# Altium schematic sheet SM2200.SchDoc
size 342 x 203 mm
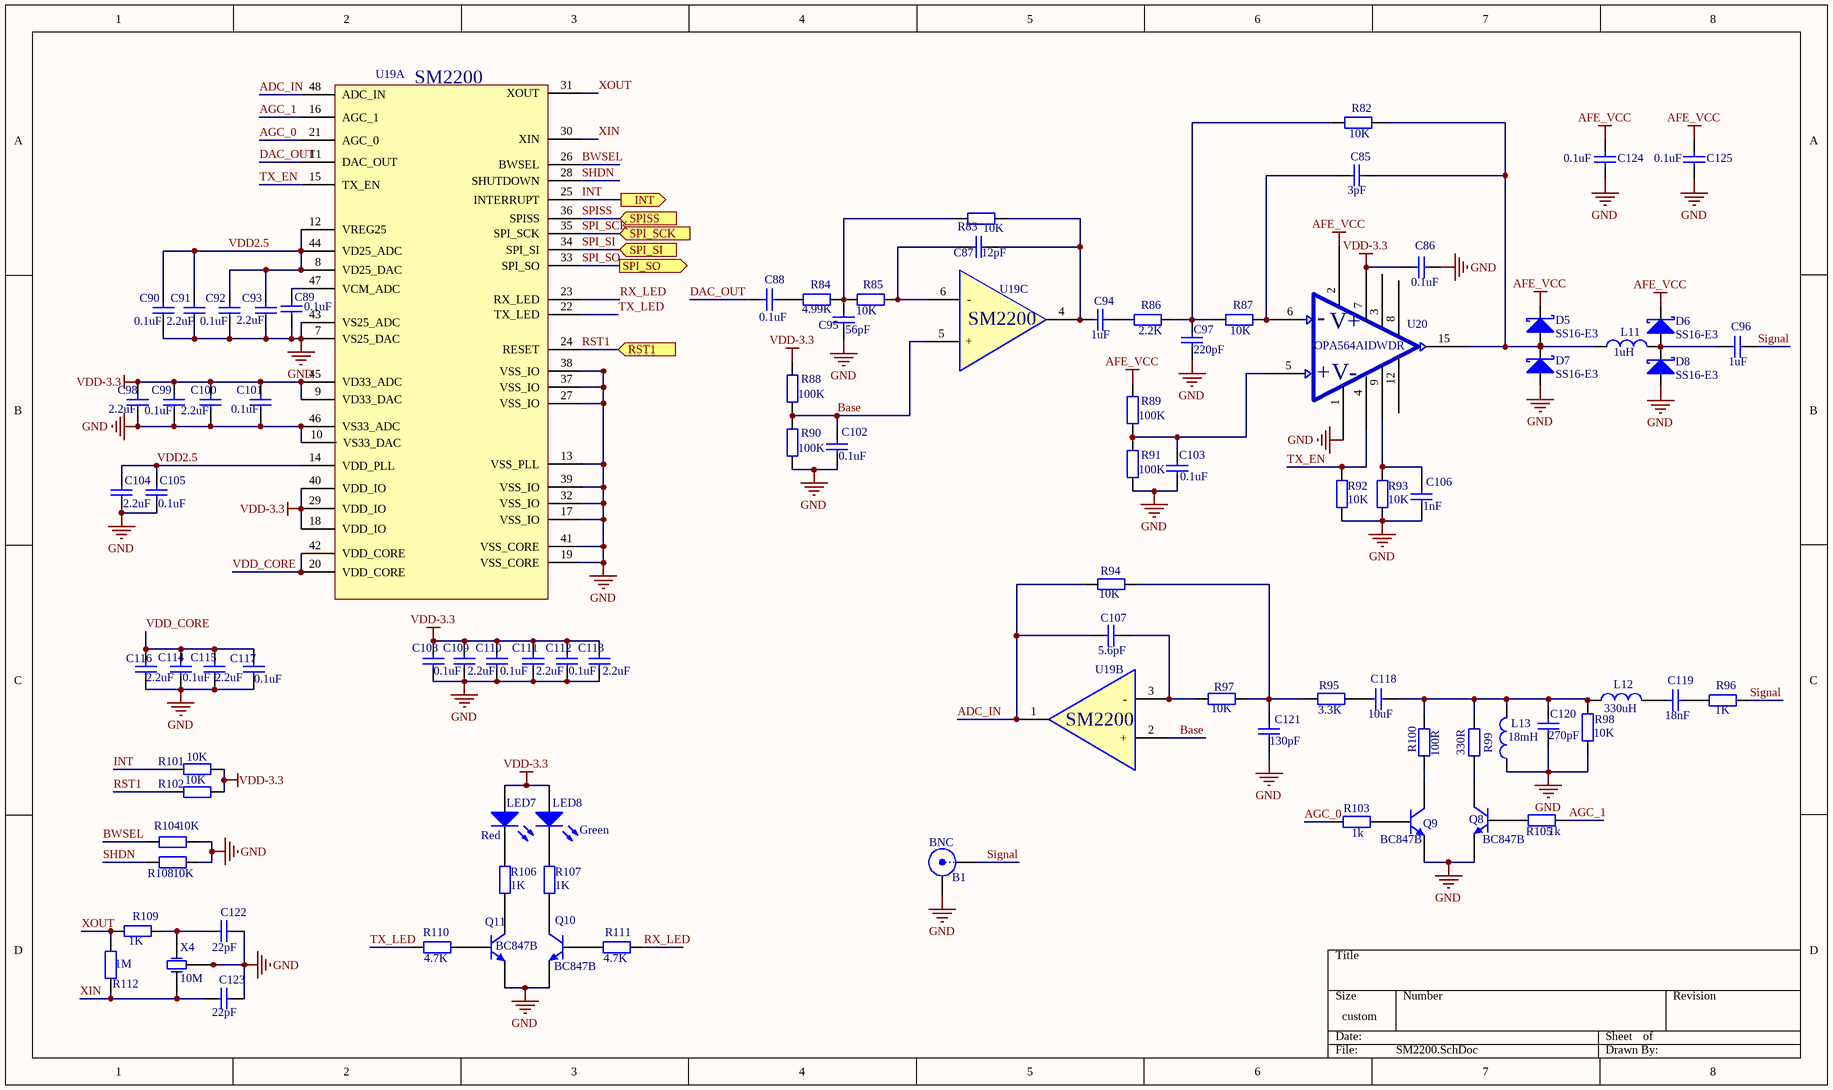
[diagram p0: SM2200.SchDoc]

## Parts
B1  BNC  [BNC]
C85  value 3pF  [0603]  (hidden comment: Capacitor-0603)
C86  value 0.1uF  [0603]  (hidden comment: Capacitor-0603)
C87  value 12pF  [0603]  (hidden comment: Capacitor-0603)
C88  value 0.1uF  [0603]  (hidden comment: Capacitor-0603)
C89  value 0.1uF  [0603]  (hidden comment: Capacitor-0805)
C90  value 0.1uF  [0603]  (hidden comment: Capacitor-0805)
C91  value 2.2uF  [0603]  (hidden comment: Capacitor-0805)
C92  value 0.1uF  [0603]  (hidden comment: Capacitor-0805)
C93  value 2.2uF  [0603]  (hidden comment: Capacitor-0805)
C94  value 1uF  [0603]  (hidden comment: Capacitor-0603)
C95  value 56pF  [0603]  (hidden comment: Capacitor-0603)
C96  value 1uF  [0603]  (hidden comment: Capacitor-0603)
C97  value 220pF  [0603]  (hidden comment: Capacitor-0603)
C98  value 2.2uF  [0603]  (hidden comment: Capacitor-0805)
C99  value 0.1uF  [0603]  (hidden comment: Capacitor-0805)
C100  value 2.2uF  [0603]  (hidden comment: Capacitor-0805)
C101  value 0.1uF  [0603]  (hidden comment: Capacitor-0805)
C102  value 0.1uF  [0603]  (hidden comment: Capacitor-0603)
C103  value 0.1uF  [0603]  (hidden comment: Capacitor-0603)
C104  value 2.2uF  [0603]  (hidden comment: Capacitor-0805)
C105  value 0.1uF  [0603]  (hidden comment: Capacitor-0805)
C106  value 1nF  [0603]  (hidden comment: Capacitor-0603)
C107  value 5.6pF  [0603]  (hidden comment: Capacitor-0603)
C108  value 0.1uF  [0603]  (hidden comment: Capacitor-0805)
C109  value 2.2uF  [0603]  (hidden comment: Capacitor-0805)
C110  value 0.1uF  [0603]  (hidden comment: Capacitor-0805)
C111  value 2.2uF  [0603]  (hidden comment: Capacitor-0805)
C112  value 0.1uF  [0603]  (hidden comment: Capacitor-0805)
C113  value 2.2uF  [0603]  (hidden comment: Capacitor-0805)
C114  value 0.1uF  [0603]  (hidden comment: Capacitor-0805)
C115  value 2.2uF  [0603]  (hidden comment: Capacitor-0805)
C116  value 2.2uF  [0603]  (hidden comment: Capacitor-0805)
C117  value 0.1uF  [0603]  (hidden comment: Capacitor-0805)
C118  value 10uF  [0805]  (hidden comment: Capacitor-0603)
C119  value 18nF  [0603]  (hidden comment: Capacitor-0603)
C120  value 270pF  [0603]  (hidden comment: Capacitor-0603)
C121  value 130pF  [0603]  (hidden comment: Capacitor-0603)
C122  value 22pF  [0603]  (hidden comment: Capacitor-0805)
C123  value 22pF  [0603]  (hidden comment: Capacitor-0805)
C124  value 0.1uF  [0603]  (hidden comment: Capacitor-0603)
C125  value 0.1uF  [0603]  (hidden comment: Capacitor-0603)
D5  Name: SS16-E3  [IN5824]  (hidden comment: SSA34)
D6  Name: SS16-E3  [IN5824]  (hidden comment: SSA34)
D7  Name: SS16-E3  [IN5824]  (hidden comment: SSA34)
D8  Name: SS16-E3  [IN5824]  (hidden comment: SSA34)
L11  value 1uH  [1206]  (hidden comment: Inductor)
L12  value 330uH  [Inductor(7.8*7*5)]  (hidden comment: Inductor)
L13  value 18mH  [工字电感0608]  (hidden comment: Inductor)
LED7  Color: Red  [外插小灯]  (hidden comment: LED)
LED8  Color: Green  [外插小灯]  (hidden comment: LED)
Q8  BC847  [BC847B]  (value not drawn)
Q9  BC847  [BC847B]  (value not drawn)
Q10  BC847  [BC847B]  (value not drawn)
Q11  BC847  [BC847B]  (value not drawn)
R82  value 10K  [0603]  (hidden comment: Resistor-0603)
R83  value 10K  [0603]  (hidden comment: Resistor-0603)
R84  value 4.99K  [0603]  (hidden comment: Resistor-0603)
R85  value 10K  [0603]  (hidden comment: Resistor-0603)
R86  value 2.2K  [0603]  (hidden comment: Resistor-0603)
R87  value 10K  [0603]  (hidden comment: Resistor-0603)
R88  value 100K  [0603]  (hidden comment: Resistor-0603)
R89  value 100K  [0603]  (hidden comment: Resistor-0603)
R90  value 100K  [0603]  (hidden comment: Resistor-0603)
R91  value 100K  [0603]  (hidden comment: Resistor-0603)
R92  value 10K  [0603]  (hidden comment: Resistor-0603)
R93  value 10K  [0603]  (hidden comment: Resistor-0603)
R94  value 10K  [0603]  (hidden comment: Resistor-0603)
R95  value 3.3K  [0603]  (hidden comment: Resistor-0603)
R96  value 1K  [0603]  (hidden comment: Resistor-0603)
R97  value 10K  [0603]  (hidden comment: Resistor-0603)
R98  value 10K  [0603]  (hidden comment: Resistor-0603)
R99  value 330R  [0603]  (hidden comment: Resistor-0603)
R100  value 100R  [0603]  (hidden comment: Resistor-0603)
R101  value 10K  [0603]  (hidden comment: Resistor-0805)
R102  value 10K  [0603]  (hidden comment: Resistor-0805)
R103  value 1k  [0603]  (hidden comment: Resistor-0603)
R104  value 10K  [0603]  (hidden comment: Resistor-0805)
R105  value 1k  [0603]  (hidden comment: Resistor-0603)
R106  value 1K  [0603]  (hidden comment: Resistor-0805)
R107  value 1K  [0603]  (hidden comment: Resistor-0805)
R108  value 10K  [0603]  (hidden comment: Resistor-0805)
R109  value 1K  [0603]  (hidden comment: Resistor-0805)
R110  value 4.7K  [0603]  (hidden comment: Resistor-0805)
R111  value 4.7K  [0603]  (hidden comment: Resistor-0805)
R112  value 1M  [0603]  (hidden comment: Resistor-0805)
U19  SM2200  [SM2200]  (parts A,B,C of 3)
U20  OPA564AIDWDR  [OPA564AIDWDR]
X4  value 10M  [3225无源晶振]  (hidden comment: 3225无源晶振)

## Ports
INT (out), RST1 (in), SPI_SCK (in), SPI_SI (in), SPI_SO (out), SPISS (in)

## Nets
AFE_VCC: C124.2 C125.2 D5.2(K) D6.2(K) R89.2 U20.2
GND: B1.1(Y) C86.1 C89.1 C90.1 C91.1 C92.1 C93.1 C95.1 C97.2 C98.1 C99.1 C100.1 C101.1 C102.1 C103.2 C104.1 C105.1 C106.1 C108.1 C109.1 C110.1 C111.1 C112.1 C113.1 C114.1 C115.1 C116.1 C117.1 C120.2 C121.2 C122.2 C123.2 C124.1 C125.1 D7.1(A) D8.1(A) L13.1 Q8.1(E) Q9.1(E) Q10.1(E) Q11.1(E) R90.1 R91.1 R92.1 R93.1 R98.1 R104.2 R108.2 U19.7(VS25_DAC) U19.10(VS33_DAC) U19.13(VSS_PLL) U19.17(VSS_IO) U19.19(VSS_CORE) U19.27(VSS_IO) U19.32(VSS_IO) U19.37(VSS_IO) U19.38(VSS_IO) U19.39(VSS_IO) U19.41(VSS_CORE) U19.43(VS25_ADC) U19.46(VS33_ADC) U20.1 X4.2(GND) X4.4(GND)
VDD-3.3: C86.2 C98.2 C99.2 C100.2 C101.2 C108.2 C109.2 C110.2 C111.2 C112.2 C113.2 LED7.1(A) LED8.1(A) R88.2 R101.2 R102.2 U19.9(VD33_DAC) U19.18(VDD_IO) U19.29(VDD_IO) U19.40(VDD_IO) U19.45(VD33_ADC) U20.7
ADC_IN: C107.1 R94.2 U19.1 U19.48(ADC_IN)
AGC_0: R103.2 U19.21(AGC_0)
AGC_1: R105.2 U19.16(AGC_1)
Base: C102.2 R88.1 R90.2 U19.2(+) U19.5(+)
BWSEL: R104.1 U19.26(BWSEL)
DAC_OUT: C88.2 U19.11(DAC_OUT)
INT: R101.1 U19.25(INTERRUPT) ; port INT
RST1: R102.1 U19.24(RESET) ; port RST1
RX_LED: R111.1 U19.23(RX_LED)
SHDN: R108.1 U19.28(SHUTDOWN)
Signal: B1.2(X) C96.1 R96.2
SPI_SCK: U19.35(SPI_SCK) ; port SPI_SCK
SPI_SI: U19.34(SPI_SI) ; port SPI_SI
SPI_SO: U19.33(SPI_SO) ; port SPI_SO
SPISS: U19.36(SPISS) ; port SPISS
TX_EN: R92.2 U19.15(TX_EN) U20.4
TX_LED: R110.2 U19.22(TX_LED)
VDD2.5: C90.2 C91.2 C92.2 C93.2 C104.2 C105.2 U19.8(VD25_DAC) U19.12(VREG25) U19.14(VDD_PLL) U19.44(VD25_ADC)
VDD_CORE: C114.2 C115.2 C116.2 C117.2 U19.20(VDD_CORE) U19.42(VDD_CORE)
XIN: C123.1 R112.1 U19.30(XIN) X4.1(OSC1)
XOUT: R109.1 R112.2 U19.31(XOUT)
NetC85_1: C85.1 D5.1(A) D7.2(K) L11.1 R82.2 U20.15
NetC85_2: C85.2 R87.2 U20.6
NetC87_1: C87.1 C94.2 R83.2 U19.4
NetC87_2: C87.2 R85.2 U19.6(-)
NetC88_1: C88.1 R84.1
NetC89_2: C89.2 U19.47(VCM_ADC)
NetC94_1: C94.1 R86.1
NetC95_2: C95.2 R83.1 R84.2 R85.1
NetC96_2: C96.2 D6.1(A) D8.2(K) L11.2
NetC97_1: C97.1 R82.1 R86.2 R87.1
NetC103_1: C103.1 R89.1 R91.2 U20.5
NetC106_2: C106.2 R93.2 U20.9
NetC107_2: C107.2 R97.2 U19.3(-)
NetC118_1: C118.1 C120.1 L12.1 L13.2 R98.2 R99.2 R100.2
NetC118_2: C118.2 R95.1
NetC119_1: C119.1 R96.1
NetC119_2: C119.2 L12.2
NetC121_1: C121.1 R94.1 R95.2 R97.1
NetC122_1: C122.1 R109.2 X4.3(OSC2)
NetLED7_2: LED7.2 R106.2
NetLED8_2: LED8.2 R107.2
NetQ8_2: Q8.2(B) R105.1
NetQ8_3: Q8.3(C) R99.1
NetQ9_2: Q9.2(B) R103.1
NetQ9_3: Q9.3(C) R100.1
NetQ10_2: Q10.2(B) R111.2
NetQ10_3: Q10.3(C) R107.1
NetQ11_2: Q11.2(B) R110.1
NetQ11_3: Q11.3(C) R106.1

Not connected (* = marked no-connect by the designer): U20 3 8 12

## Notes on the sheet
- (in symbol OPA564AIDWDR) -; V+; +; V-

## Library data of the parts
C89-C93 C98-C101 C104 C105 C108-C117 C122 C123 = Capacito
R101 R102 R104 R106-R112 = Resisto
U20 = OPA564AIDWDR: pin to pad: 1>1+10+11+20+13+14; Name: OPA564AIDWDR
B1 = BNC: Name: BNC
LED7 LED8 = LED: Value: LED
Q8-Q11 = BC847: Name: BC847B